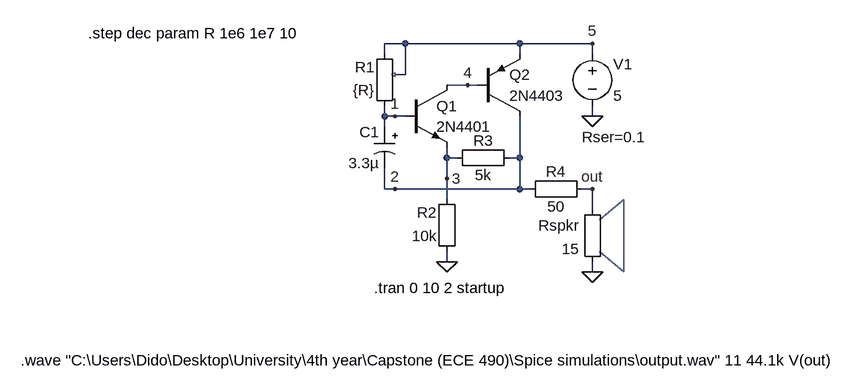
[diagram p0: schematic Metronome circuit.asc]
Metronome circuit.asc, the LTspice schematic file:
Version 4
SHEET 1 1548 1604
WIRE 720 640 688 640
WIRE 896 640 720 640
WIRE 1008 640 896 640
WIRE 688 656 688 640
WIRE 896 656 896 640
WIRE 1008 656 1008 640
WIRE 720 688 720 640
WIRE 720 688 704 688
WIRE 816 704 784 704
WIRE 832 704 816 704
WIRE 688 752 688 736
WIRE 704 752 688 752
WIRE 720 752 704 752
WIRE 1008 752 1008 736
WIRE 688 768 688 752
WIRE 784 816 784 800
WIRE 800 816 784 816
WIRE 896 816 896 752
WIRE 896 816 880 816
WIRE 784 848 784 816
WIRE 688 864 688 832
WIRE 704 864 688 864
WIRE 896 864 896 816
WIRE 896 864 704 864
WIRE 912 864 896 864
WIRE 1008 864 992 864
WIRE 784 880 784 848
WIRE 1008 896 1008 864
WIRE 784 976 784 960
WIRE 1008 992 1008 976
FLAG 1008 752 0
FLAG 1008 992 0
FLAG 784 976 0
FLAG 1008 864 out
FLAG 704 752 1
FLAG 704 864 2
FLAG 784 848 3
FLAG 816 704 4
FLAG 1008 640 5
SYMBOL Misc\\EuropeanResistor 704 752 R180
WINDOW 0 31 76 Left 2
WINDOW 3 31 40 Left 2
SYMATTR InstName R1
SYMATTR Value {R}
SYMBOL polcap 704 768 M0
WINDOW 3 24 56 Left 2
SYMATTR Value 3.3µ
SYMATTR InstName C1
SYMATTR Description Capacitor
SYMATTR Type cap
SYMATTR SpiceLine V=16 Irms=0 Rser=5 Lser=0 mfg="AVX" pn="TAJA335M016" type="Tantalum"
SYMBOL npn2 720 704 R0
WINDOW 3 48 64 Left 2
WINDOW 0 48 32 Left 2
SYMATTR Value 2N4401
SYMATTR InstName Q1
SYMBOL Misc\\EuropeanResistor 800 976 R180
WINDOW 0 31 76 Left 2
WINDOW 3 31 40 Left 2
SYMATTR InstName R2
SYMATTR Value 10k
SYMBOL Misc\\EuropeanResistor 784 832 R270
WINDOW 0 27 56 VTop 2
WINDOW 3 5 56 VBottom 2
SYMATTR InstName R3
SYMATTR Value 5k
SYMBOL pnp2 832 752 M180
WINDOW 0 48 64 Left 2
WINDOW 3 48 32 Left 2
SYMATTR InstName Q2
SYMATTR Value 2N4403
SYMBOL Misc\\EuropeanResistor 896 848 M90
WINDOW 0 5 56 VBottom 2
WINDOW 3 27 56 VTop 2
SYMATTR InstName R4
SYMATTR Value 50
SYMBOL voltage 1008 640 R0
WINDOW 123 0 0 Left 2
WINDOW 39 -16 144 Left 2
WINDOW 3 32 80 Left 2
WINDOW 0 32 32 Left 2
SYMATTR SpiceLine Rser=0.1
SYMATTR Value 5
SYMATTR InstName V1
SYMBOL Misc\\EuropeanResistor 1024 880 M0
SYMATTR InstName Rspkr
SYMATTR Value 15
TEXT 672 1016 Left 2 !.tran 0 10 2 startup
TEXT 232 624 Left 2 !.step dec param R 1e6 1e7 10
TEXT 128 1128 Left 2 !.wave "C:\\Users\\Dido\\Desktop\\University\\4th year\\Capstone (ECE 490)\\Spice simulations\\output.wav" 11 44.1k V(out)
LINE Normal 1056 880 1019 912
LINE Normal 1056 992 1056 880
LINE Normal 1019 960 1056 992
LINE Normal 704 685 704 691
LINE Normal 704 691 699 688
LINE Normal 704 685 699 688

The netlist it stands for:
* Metronome circuit.asc
R1 1 5 {R}
C1 1 2 3.3µ V=16 Irms=0 Rser=5 Lser=0 mfg="AVX" pn="TAJA335M016" type="Tantalum"
Q1 4 1 3 0 2N4401
R2 0 3 10k
R3 3 2 5k
Q2 2 4 5 0 2N4403
R4 2 out 50
V1 5 0 5 Rser=0.1
Rspkr out 0 15
.model NPN NPN
.model PNP PNP
.lib standard.bjt
.tran 0 10 2 startup
.step dec param R 1e6 1e7 10
.wave "C:\Users\Dido\Desktop\University\4th year\Capstone (ECE 490)\Spice simulations\output.wav" 11 44.1k V(out)
.backanno
.end